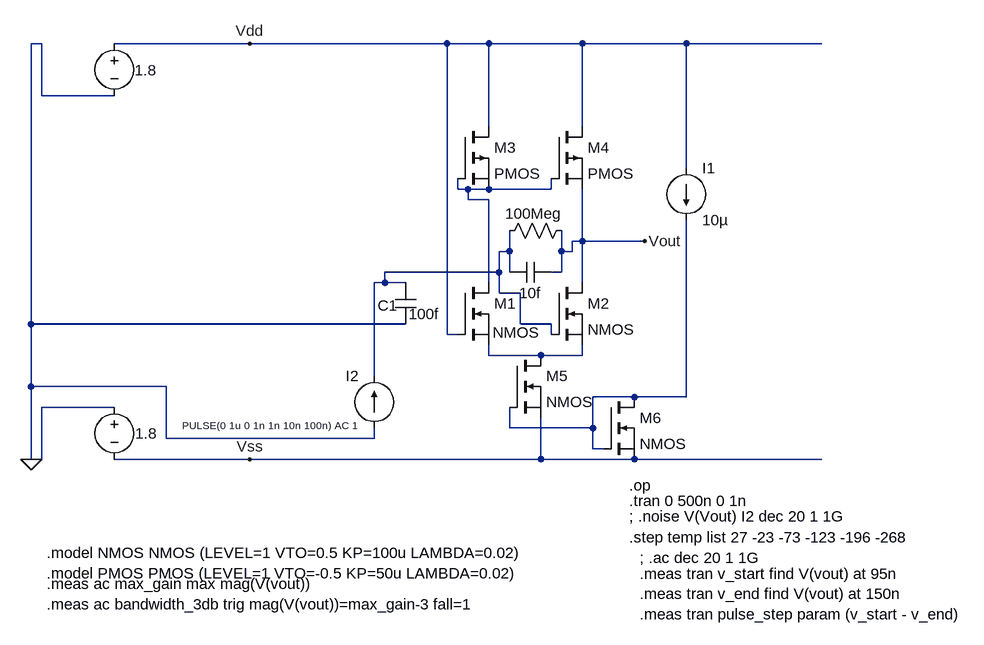
[diagram p0: schematic csa-frontend-CM.asc]
csa-frontend-CM.asc, the LTspice schematic file:
Version 4
SHEET 1 1236 908
WIRE -192 32 -208 32
WIRE 128 32 -80 32
WIRE 432 32 128 32
WIRE 496 32 432 32
WIRE 640 32 496 32
WIRE 800 32 640 32
WIRE 1008 32 800 32
WIRE -192 112 -192 32
WIRE -80 112 -192 112
WIRE 496 160 496 32
WIRE 640 160 640 32
WIRE 800 224 800 32
WIRE 448 256 448 240
WIRE 464 256 448 256
WIRE 496 256 464 256
WIRE 592 256 592 240
WIRE 592 256 496 256
WIRE 464 272 464 256
WIRE 496 272 464 272
WIRE 640 336 640 256
WIRE 640 336 624 336
WIRE 736 336 640 336
WIRE 528 352 528 320
WIRE 528 352 512 352
WIRE 608 352 608 320
WIRE 624 352 624 336
WIRE 624 352 608 352
WIRE 512 384 512 352
WIRE 512 384 336 384
WIRE 528 384 528 352
WIRE 608 384 608 352
WIRE 608 384 592 384
WIRE 336 400 336 384
WIRE 336 400 320 400
WIRE 368 400 336 400
WIRE 496 400 496 272
WIRE 640 400 640 336
WIRE 512 416 512 384
WIRE 544 416 512 416
WIRE -208 464 -208 32
WIRE 368 464 -208 464
WIRE 544 464 544 416
WIRE 592 464 544 464
WIRE 432 480 432 32
WIRE 448 480 432 480
WIRE 592 480 592 464
WIRE 496 512 496 496
WIRE 576 512 496 512
WIRE 640 512 640 496
WIRE 640 512 576 512
WIRE 320 544 320 400
WIRE -208 560 -208 464
WIRE 0 560 -208 560
WIRE 720 576 656 576
WIRE 800 576 800 304
WIRE 800 576 720 576
WIRE -80 592 -192 592
WIRE 528 624 528 592
WIRE 656 624 656 576
WIRE 656 624 528 624
WIRE 0 640 0 560
WIRE 320 640 320 624
WIRE 320 640 0 640
WIRE 656 656 656 624
WIRE 672 656 656 656
WIRE -208 672 -208 560
WIRE -192 672 -192 592
WIRE -192 672 -208 672
WIRE 128 672 -80 672
WIRE 576 672 576 608
WIRE 576 672 128 672
WIRE 720 672 576 672
WIRE 1008 672 720 672
FLAG -208 672 0
FLAG 128 32 Vdd
FLAG 128 672 Vss
FLAG 736 336 Vout
SYMBOL voltage -80 16 R0
WINDOW 0 24 16 Invisible 2
WINDOW 3 31 57 Left 2
SYMATTR InstName Vdd
SYMATTR Value 1.8
SYMBOL voltage -80 576 R0
WINDOW 0 24 16 Invisible 2
WINDOW 3 32 56 Left 2
SYMATTR InstName Vss
SYMATTR Value 1.8
SYMBOL nmos 448 400 R0
WINDOW 3 54 77 Left 2
SYMATTR InstName M1
SYMBOL nmos 592 400 R0
SYMATTR InstName M2
SYMBOL pmos 448 160 R0
SYMATTR InstName M3
SYMBOL pmos 592 160 R0
SYMATTR InstName M4
SYMBOL cap 352 400 R0
WINDOW 0 -27 35 Left 2
WINDOW 3 21 48 Left 2
SYMATTR InstName C1
SYMATTR Value 100f
SYMBOL current 320 624 R180
WINDOW 0 24 80 Left 2
WINDOW 3 296 4 Right 1
SYMATTR InstName I2
SYMATTR Value PULSE(0 1u 0 1n 1n 10n 100n) AC 1
SYMBOL res 624 304 R90
WINDOW 0 -22 56 Invisible 2
WINDOW 3 -26 59 VTop 2
SYMATTR InstName R1
SYMATTR Value 100Meg
SYMBOL cap 592 368 R90
WINDOW 0 0 32 Invisible 2
WINDOW 3 32 32 VTop 2
SYMATTR InstName C2
SYMATTR Value 10f
SYMBOL nmos 528 512 R0
SYMATTR InstName M5
SYMBOL nmos 672 576 R0
SYMATTR InstName M6
SYMBOL current 800 224 R0
SYMATTR InstName I1
SYMATTR Value 10µ
TEXT -184 816 Left 2 !.model NMOS NMOS (LEVEL=1 VTO=0.5 KP=100u LAMBDA=0.02)\n.model PMOS PMOS (LEVEL=1 VTO=-0.5 KP=50u LAMBDA=0.02)
TEXT 712 736 Left 2 !.tran 0 500n 0 1n
TEXT 712 712 Left 2 !.op
TEXT 712 760 Left 2 !; .noise V(Vout) I2 dec 20 1 1G
TEXT 712 792 Left 2 !.step temp list 27 -23 -73 -123 -196 -268
TEXT 728 824 Left 2 !; .ac dec 20 1 1G
TEXT -184 864 Left 2 !.meas ac max_gain max mag(V(vout))\n.meas ac bandwidth_3db trig mag(V(vout))=max_gain-3 fall=1
TEXT 728 848 Left 2 !.meas tran v_start find V(vout) at 95n\n.meas tran v_end find V(vout) at 150n\n.meas tran pulse_step param (v_start - v_end)

The netlist it stands for:
* csa-frontend-CM.asc
Vdd Vdd 0 1.8
Vss 0 Vss 1.8
M1 N001 Vdd N003 N003 NMOS
M2 Vout N002 N003 N003 NMOS
M3 Vdd N001 N001 N001 PMOS
M4 Vdd N001 Vout Vout PMOS
C1 N002 0 100f
I2 0 N002 PULSE(0 1u 0 1n 1n 10n 100n) AC 1
R1 Vout N002 100Meg
C2 Vout N002 10f
M5 N003 N004 Vss Vss NMOS
M6 N004 N004 Vss Vss NMOS
I1 Vdd N004 10µ
.model NMOS NMOS
.model PMOS PMOS
.lib standard.mos
.model NMOS NMOS (LEVEL=1 VTO=0.5 KP=100u LAMBDA=0.02)
.model PMOS PMOS (LEVEL=1 VTO=-0.5 KP=50u LAMBDA=0.02)
.tran 0 500n 0 1n
.op
; .noise V(Vout) I2 dec 20 1 1G
.step temp list 27 -23 -73 -123 -196 -268
; .ac dec 20 1 1G
.meas ac max_gain max mag(V(vout))
.meas ac bandwidth_3db trig mag(V(vout))=max_gain-3 fall=1
.meas tran v_start find V(vout) at 95n
.meas tran v_end find V(vout) at 150n
.meas tran pulse_step param (v_start - v_end)
.backanno
.end